# EAGLE schematic WWIII-02 (EAGLE 8.4.3)
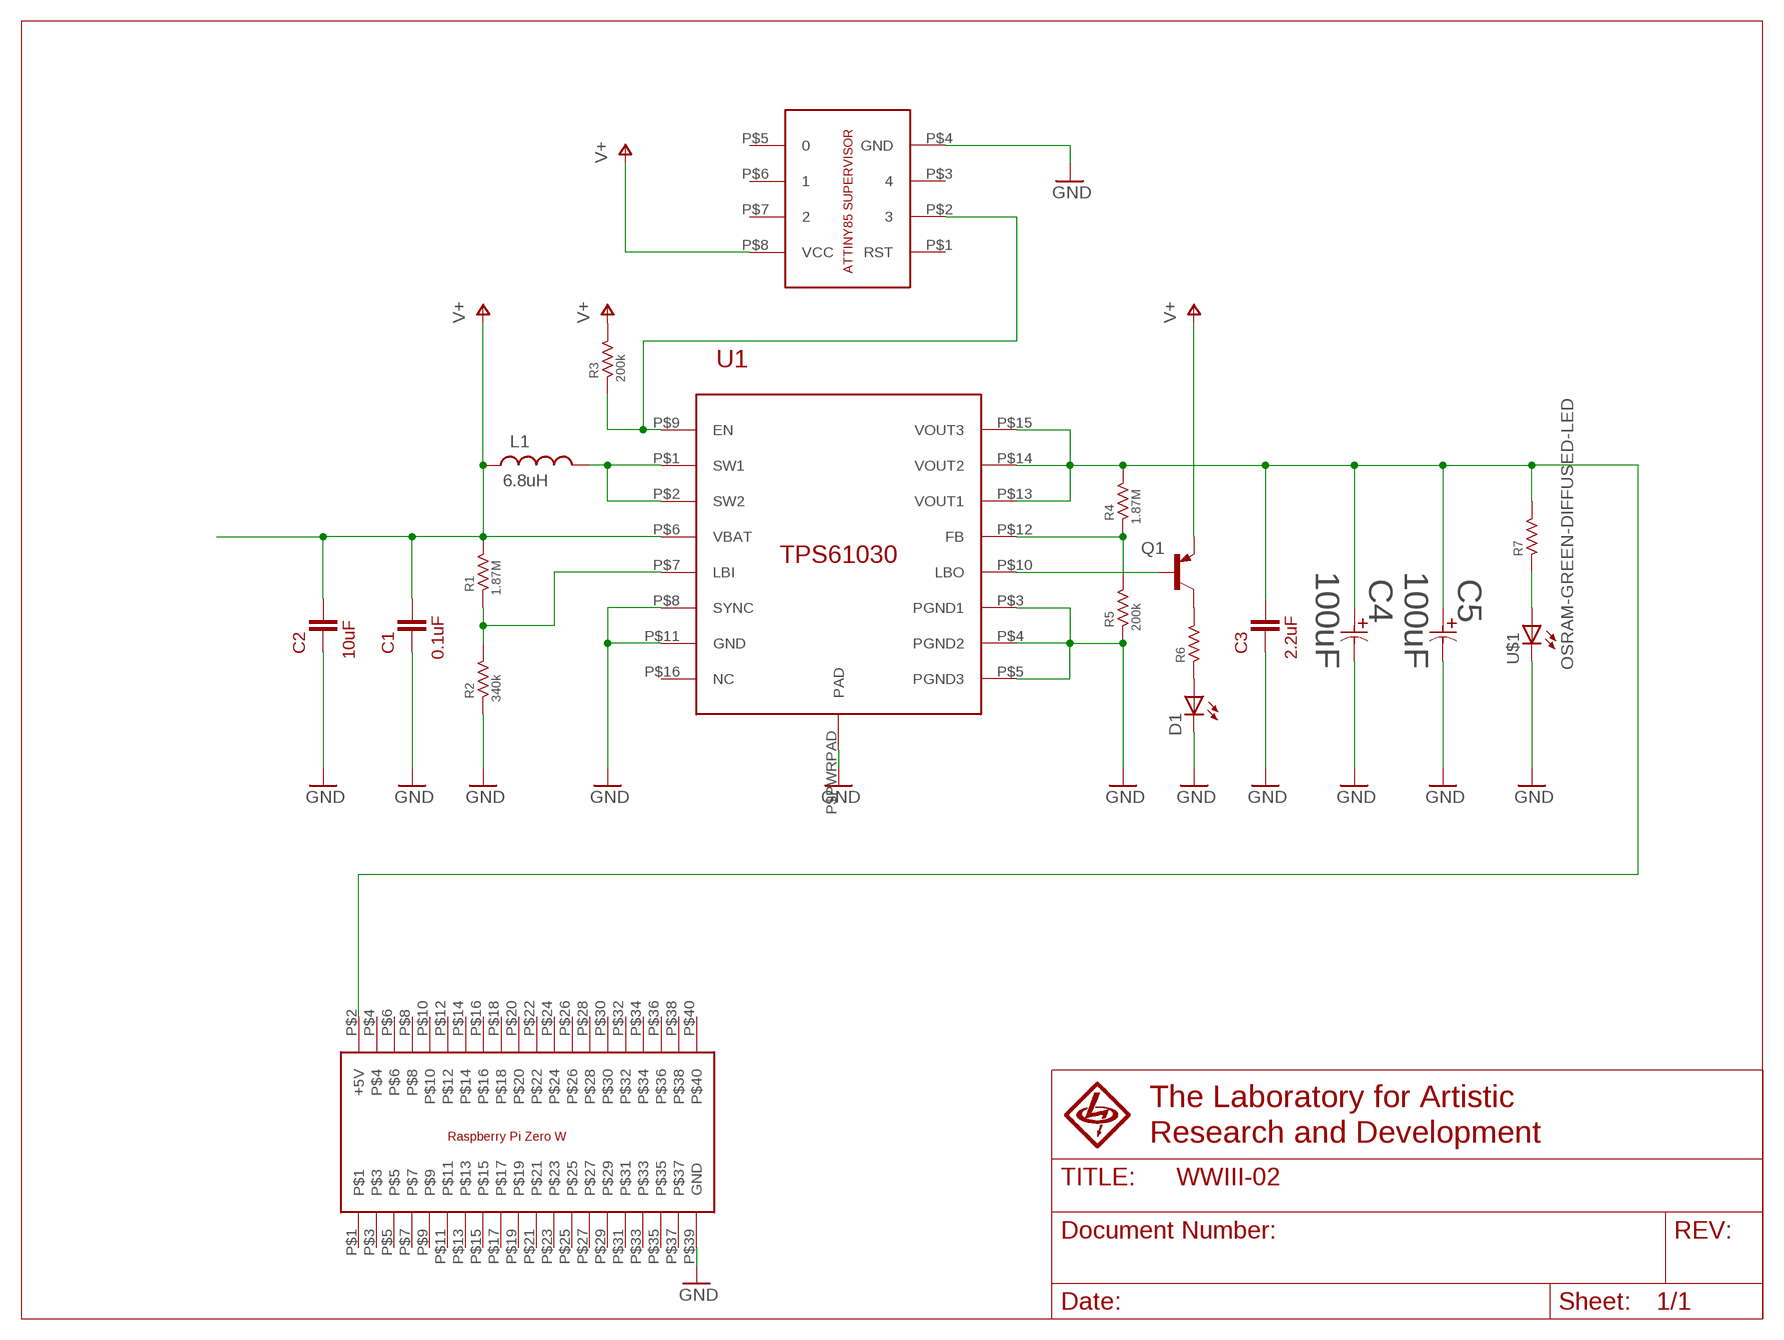
[diagram p0: schematic, sheet 1]

## Parts
C1  0.1uF  AVX-SMD-CERAMIC-CAPACITOR-0805-0.1UF  [0805]
C2  10uF  KEMET-SMD-CERAMIC-CAPACITOR-10UF  [KEM_C1006_X5R_SMD]
C3  2.2uF  TAIYO-SMD-CERAMIC-CAPACITOR-0805-2.2UF  [CAP-X5R]
C4  100uF  PANASONIC-SMD-ELECTROLYTIC-CAPACITOR-100UF  [CAP_EEE_C]
C5  100uF  PANASONIC-SMD-ELECTROLYTIC-CAPACITOR-100UF  [CAP_EEE_C]
D1  OSRAM-RED-DIFFUSED-LED  [OSRAM_CHIPLED]
L1  6.8uH  TDK-SMD-FIXED-INDUCTOR  [MLZ2012]
Q1  ON-SEMI-SMD-PREBIAS-TRANS-SOT23  [SOT23-3]
R1  1.87M  YAGEO-SMD-1/8W-RESISTOR-0805  [RC0805N]
R2  340k  YAGEO-SMD-1/8W-RESISTOR-0805  [RC0805N]
R3  200k  STACKPOLE-SMD-1/8W-RESISTOR-0805  [RESISTOR-0805]
R4  1.87M  PANASONIC-SMD-RESISTOR-0805-1.87M  [PANASONIC-SMD-RESISTOR-0805]
R5  200k  STACKPOLE-SMD-1/8W-RESISTOR-0805  [RESISTOR-0805]
R6  YAGEO-SMD-1/8W-RESISTOR-0805  [RC0805N]
R7  YAGEO-SMD-1/8W-RESISTOR-0805  [RC0805N]
U1  TPS61030  [TPS61030PWPR]
U2  RASPBERRY-PI  [RASPBERRY-PI]
U3  ATTINY-SUPERVISOR  [ATTINY-SOCKETED]
U$1  OSRAM-GREEN-DIFFUSED-LED  [OSRAM_CHIPLED]

## Nets
GND: C1.1 C2.1 C3.1 C4.2 C5.2 D1.P$2 R2.1 R5.1 U1.P$3(PGND1) U1.P$4(PGND2) U1.P$5(PGND3) U1.P$8(SYNC) U1.P$11(GND) U1.P$PWRPAD(PAD) U2.P$39(GND) U3.P$4(GND) U$1.P$2
N$1: R4.P$1 R5.2 U1.P$12(FB)
N$2: L1.2 U1.P$1(SW1) U1.P$2(SW2)
N$3: C3.2 C4.1 C5.1 R4.P$2 R7.2 U1.P$13(VOUT1) U1.P$14(VOUT2) U1.P$15(VOUT3) U2.P$2(+5V)
N$4: R7.1 U$1.P$1
N$5: R1.1 R2.2 U1.P$7(LBI)
N$6: Q1.1 U1.P$10(LBO)
N$7: R3.1 U1.P$9(EN) U3.P$2
N$8: Q1.3 R6.2
N$9: D1.P$1 R6.1
V+: C1.2 C2.2 L1.1 Q1.2 R1.2 R3.2 U1.P$6(VBAT) U3.P$8(VCC)
Unconnected: U1.P$16(NC) U2.P$1 U2.P$3 U2.P$4 U2.P$5 U2.P$6 U2.P$7 U2.P$8 U2.P$9 U2.P$10 U2.P$11 U2.P$12 U2.P$13 U2.P$14 U2.P$15 U2.P$16 U2.P$17 U2.P$18 U2.P$19 U2.P$20 U2.P$21 U2.P$22 U2.P$23 U2.P$24 U2.P$25 U2.P$26 U2.P$27 U2.P$28 U2.P$29 U2.P$30 U2.P$31 U2.P$32 U2.P$33 U2.P$34 U2.P$35 U2.P$36 U2.P$37 U2.P$38 U2.P$40 U3.P$1(RST) U3.P$3 U3.P$5 U3.P$6 U3.P$7

## Library data of the parts
C1 = balogh:AVX-SMD-CERAMIC-CAPACITOR-0805-0.1UF; MANUFACTURER_PART_NUMBER: 08055C104KAT2A; VENDOR: AVX Corporation
C2 = balogh:KEMET-SMD-CERAMIC-CAPACITOR-10UF: Digikey Part Number:
C3 = balogh:TAIYO-SMD-CERAMIC-CAPACITOR-0805-2.2UF: EMK212BJ225KG-T Taiyo Yuden SMD Ceramic Capacitor 0805 2.2uF Digikey PN: 587-1293-1-ND
C4 C5 = balogh:PANASONIC-SMD-ELECTROLYTIC-CAPACITOR-100UF: EEE-1AA101WR Panasonic SMD Electrolytic Capacitor Digikey Part Number: PCE3867CT-ND; MANUFACTURER_PART_NUMBER: EEE1AA101WR; VENDOR: Panasonic
D1 = balogh:OSRAM-RED-DIFFUSED-LED
L1 = balogh:TDK-SMD-FIXED-INDUCTOR: TDK MLZ2012 FIXED INDUCTOR Digikey Part: 445-6402-1-ND
Q1 = balogh:ON-SEMI-SMD-PREBIAS-TRANS-SOT23: MMUN2133LT1G On Semiconductor SMD Prebiased Transistor MMUN2133LT1GOSCT-ND
R1 R2 R6 R7 = balogh:YAGEO-SMD-1/8W-RESISTOR-0805: RC0805JR0710KL Yageo SMD 1/8W Resitsor 0805 Digikey PN: 311-10KARCT-ND; MANUFACTURER_PART_NUMBER: RC0805JR0710KL; VENDOR: Yageo
R3 R5 = balogh:STACKPOLE-SMD-1/8W-RESISTOR-0805: Generic SMD 1/8W Resistor 0805 Digikey Part Number:
R4 = balogh:PANASONIC-SMD-RESISTOR-0805-1.87M
U1 = balogh:TPS61030: TPS61030 TI Synchronous Boost Converter w/ 4A Switch Digikey PN: 296-14416-1-ND
U2 = balogh:RASPBERRY-PI
U3 = balogh:ATTINY-SUPERVISOR
U$1 = balogh:OSRAM-GREEN-DIFFUSED-LED